# EAGLE design watering (EAGLE 8.3.1)
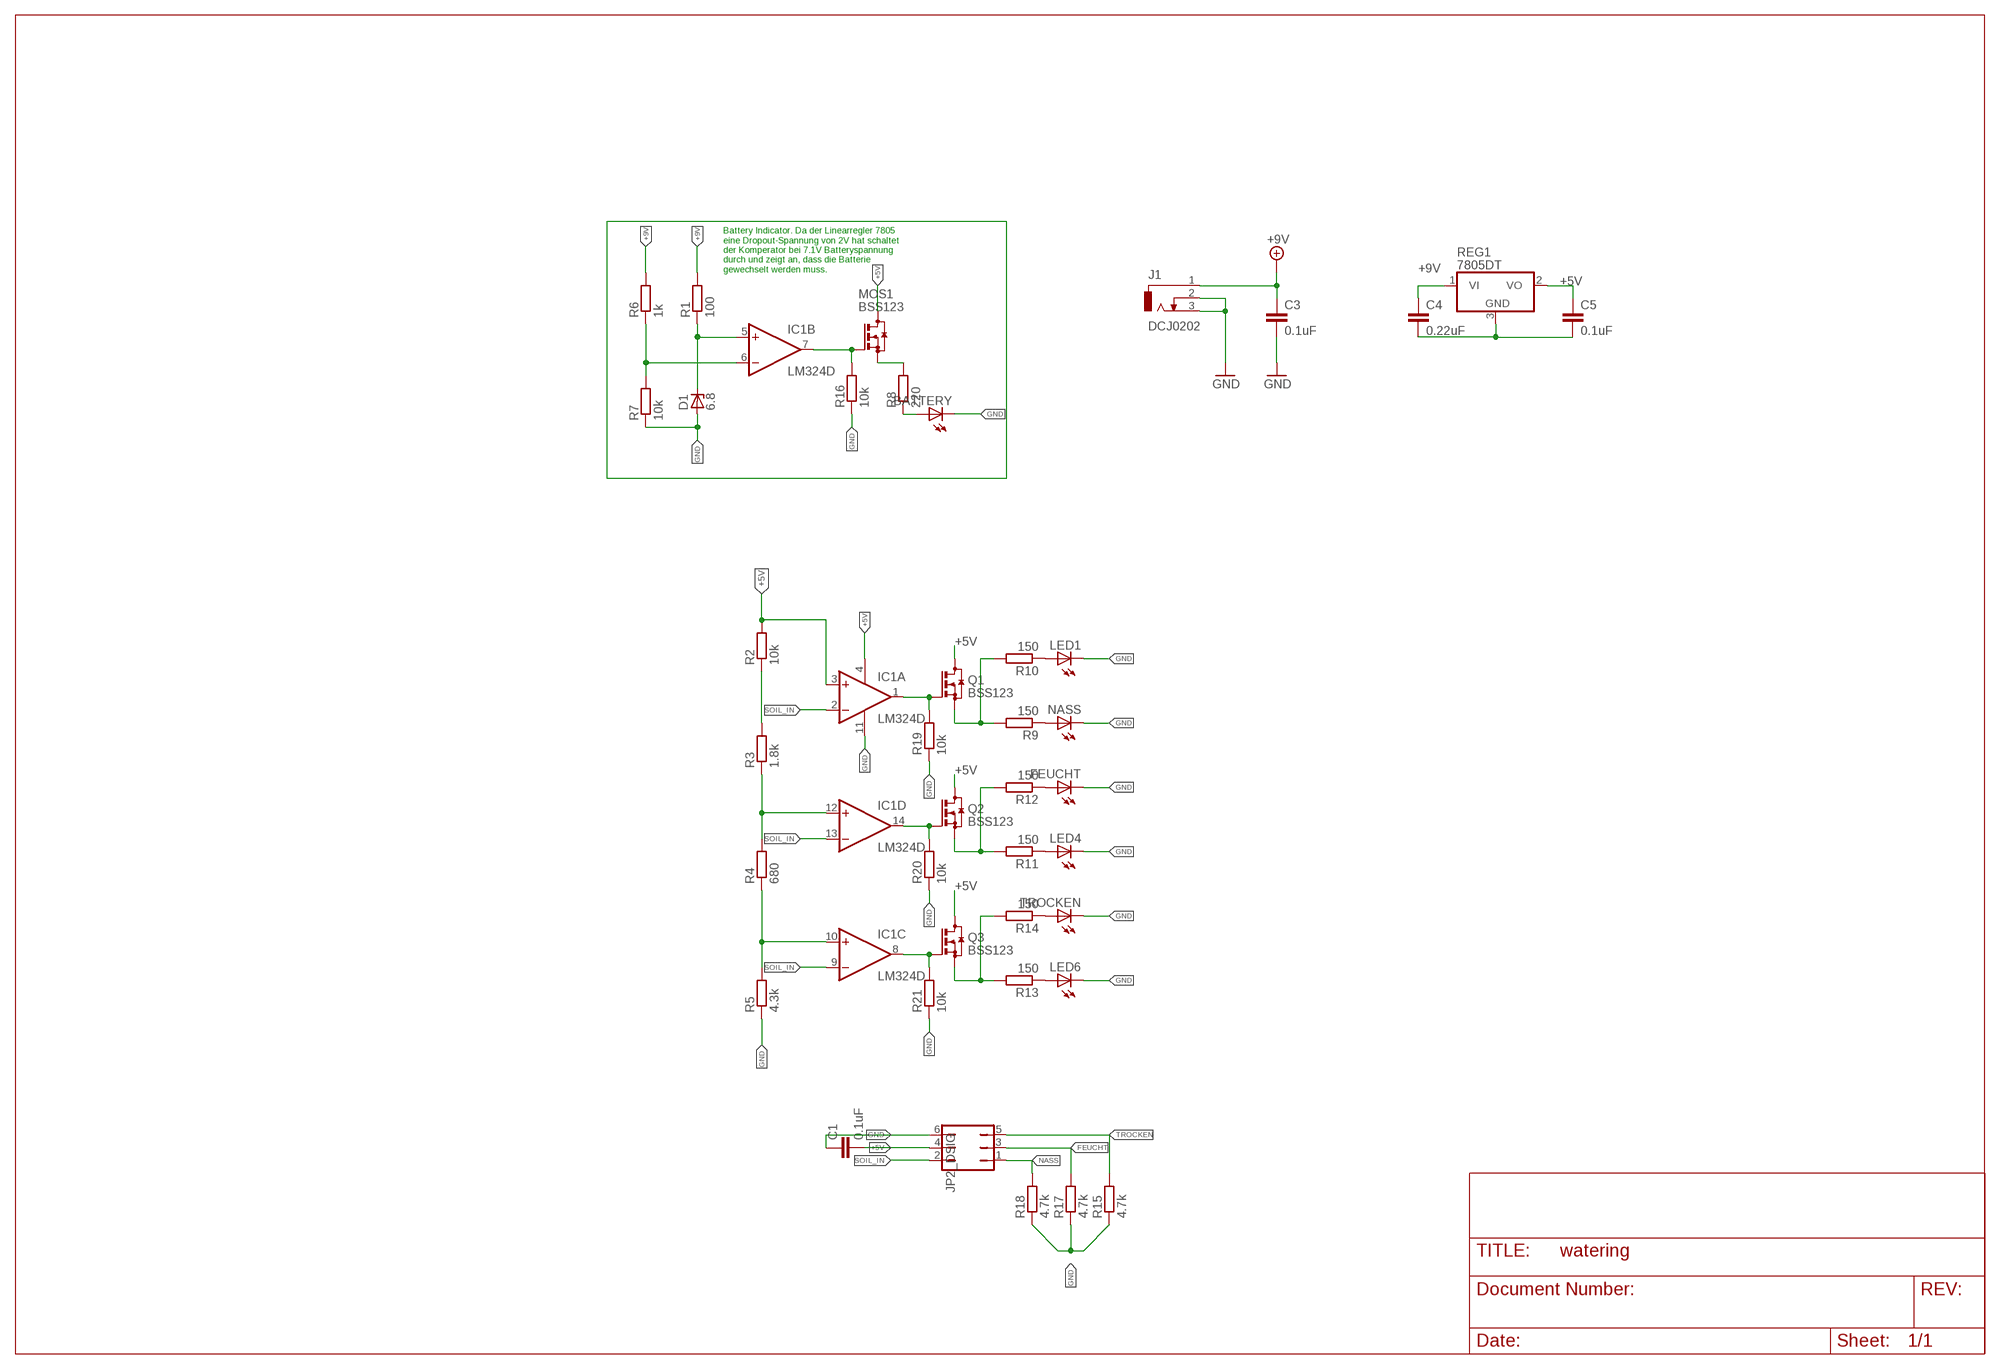
[diagram p0: schematic, sheet 1]

## Parts
BATTERY  LEDSML0805  [SML0805]
C1  0.1uF  C-EUC0805  [C0805]
C3  0.1uF  C-EUC0805  [C0805]
C4  0.22uF  C-EUC0805  [C0805]
C5  0.1uF  C-EUC0805  [C0805]
D1  6.8  ZENER-DIODESMB  [SMB]
FEUCHT  LEDSML0805  [SML0805]
IC1  LM324D  [SO14]
J1  DCJ0202  [DCJ0202]
JP1  JP2_DSIG  JP3Q  [JP3Q]
LED1  LEDSML0805  [SML0805]
LED4  LEDSML0805  [SML0805]
LED6  LEDSML0805  [SML0805]
MOS1  BSS123  [SOT23]
NASS  LEDSML0805  [SML0805]
Q1  BSS123  [SOT23]
Q2  BSS123  [SOT23]
Q3  BSS123  [SOT23]
R1  100  R-EU_M0805  [M0805]
R2  10k  R-EU_M0805  [M0805]
R3  1.8k  R-EU_M0805  [M0805]
R4  680  R-EU_M0805  [M0805]
R5  4.3k  R-EU_M0805  [M0805]
R6  1k  R-EU_M0805  [M0805]
R7  10k  R-EU_M0805  [M0805]
R8  220  R-EU_M0805  [M0805]
R9  150  R-EU_M0805  [M0805]
R10  150  R-EU_M0805  [M0805]
R11  150  R-EU_M0805  [M0805]
R12  150  R-EU_M0805  [M0805]
R13  150  R-EU_M0805  [M0805]
R14  150  R-EU_M0805  [M0805]
R15  4.7k  R-EU_M0805  [M0805]
R16  10k  R-EU_M0805  [M0805]
R17  4.7k  R-EU_M0805  [M0805]
R18  4.7k  R-EU_M0805  [M0805]
R19  10k  R-EU_M0805  [M0805]
R20  10k  R-EU_M0805  [M0805]
R21  10k  R-EU_M0805  [M0805]
REG1  7805DT  [TO252]
TROCKEN  LEDSML0805  [SML0805]

## Nets
+5V: C1.2 C5.1 IC1.3(A:+IN) IC1.4(P:V+) JP1.4 MOS1.3(D) Q1.3(D) Q2.3(D) Q3.3(D) R2.2 REG1.2(VO)
+9V: C3.1 C4.1 J1.1 R1.2 R6.2 REG1.1(VI)
FEUCHT: JP1.3 Q2.2(S) R11.2 R12.2 R17.2
GND: BATTERY.C C1.1 C3.2 C4.2 C5.2 D1.A FEUCHT.C IC1.11(P:V-) J1.2 J1.3 JP1.6 LED1.C LED4.C LED6.C NASS.C R5.1 R7.1 R15.1 R16.1 R17.1 R18.1 R19.1 R20.1 R21.1 REG1.3(GND) TROCKEN.C
N$1: R2.1 R3.2
N$2: IC1.1(A:OUT) Q1.1(G) R19.2
N$3: D1.C IC1.5(B:+IN) R1.1
N$4: IC1.14(D:OUT) Q2.1(G) R20.2
N$5: IC1.8(C:OUT) Q3.1(G) R21.2
N$6: IC1.6(B:-IN) R6.1 R7.2
N$7: IC1.7(B:OUT) MOS1.1(G) R16.2
N$8: MOS1.2(S) R8.2
N$9: BATTERY.A R8.1
N$10: LED1.A R10.1
N$11: IC1.12(D:+IN) R3.1 R4.2
N$12: IC1.10(C:+IN) R4.1 R5.2
N$13: NASS.A R9.1
N$21: FEUCHT.A R12.1
N$22: LED4.A R11.1
N$23: R14.1 TROCKEN.A
N$24: LED6.A R13.1
NASS: JP1.1 Q1.2(S) R9.2 R10.2 R18.2
SOIL_IN: IC1.2(A:-IN) IC1.9(C:-IN) IC1.13(D:-IN) JP1.2
TROCKEN: JP1.5 Q3.2(S) R13.2 R14.2 R15.2

## Notes on the sheet
- Battery Indicator. Da der Linearregler 7805
  eine Dropout-Spannung von 2V hat schaltet 
  der Komperator bei 7.1V Batteryspannung 
  durch und zeigt an, dass die Batterie 
  gewechselt werden muss.

## Library data of the parts
BATTERY FEUCHT LED1 LED4 LED6 NASS TROCKEN = led:LED: LED OSRAM: - CHIPLED LG R971, LG N971, LY N971, LG Q971, LY Q971, LO R971, LY R971 LH N974, LH R974 LS Q976, LO Q976, LY Q976 LO Q996 - Hyper CHIPLED LW Q18S LB Q993, LB Q99A, LB R99A - SideLED LS A670, LO A670, LY A670, LG A670, LP A670 LB A673, LV A673, LT A673, LW A673 LH A674 LY A675 LS A676, LA A676, LO A676, LY A676, LW A676 LS A679, LY A679, LG A679 - Hyper Micro SIDELED® LS Y876, LA Y876, LO Y876, LY Y876 LT Y87S - SmartLED LW L88C, LW L88S LB L89C, LB L89S, LG L890 LS L89K, LO L89K, LY L89K LS L896, LA L896, LO L896, LY L896 - TOPLED LS T670, LO T670, LY T670, LG T670, LP T670 LSG T670, LSP T670, LSY T670, LOP T670, LYG T670 LG T671, LOG T671, LSG T671 LB T673, LV T673, LT T673, LW T673 LH T674 LS T676, LA T676, LO T676, LY T676, LB T676, LH T676, LSB T676, LW T676 LB T67C, LV T67C, LT T67C, LS T67K, LO T67K, LY T67K, LW E67C LS E67B, LA E67B, LO E67B, LY E67B, LB E67C, LV E67C, LT E67C LW T67C LS T679, LY T679, LG T679 LS T770, LO T770, LY T770, LG T770, LP T770 LB T773, LV T773, LT T773, LW T773 LH T774 LS E675, LA E675, LY E675, LS T675 LS T776, LA T776, LO T776, LY T776, LB T776 LHGB T686 LT T68C, LB T68C - Hyper Mini TOPLED® LB M676 - Mini TOPLED Santana® LG M470 LS M47K, LO M47K, LY M47K Source: http://www.osram.convergy.de LUXEON: - LUMILED® LXK2-PW12-R00, LXK2-PW12-S00, LXK2-PW14-U00, LXK2-PW14-V00 LXK2-PM12-R00, LXK2-PM12-S00, LXK2-PM14-U00 LXK2-PE12-Q00, LXK2-PE12-R00, LXK2-PE12-S00, LXK2-PE14-T00, LXK2-PE14-U00 LXK2-PB12-K00, LXK2-PB12-L00, LXK2-PB12-M00, LXK2-PB14-N00, LXK2-PB14-P00, LXK2-PB14-Q00 LXK2-PR12-L00, LXK2-PR12-M00, LXK2-PR14-Q00, LXK2-PR14-R00 LXK2-PD12-Q00, LXK2-PD12-R00, LXK2-PD12-S00 LXK2-PH12-R00, LXK2-PH12-S00 LXK2-PL12-P00, LXK2-PL12-Q00, LXK2-PL12-R00 Source: www.luxeon.com KINGBRIGHT: KA-3528ASYC Source: www.kingbright.com
C1 C3-C5 = rcl:C-EU: CAPACITOR, European symbol
D1 = diode:ZENER-DIODE: Z-Diode
IC1 = linear:LM324: OP AMP
J1 = con-jack:DCJ0202: DC POWER JACK Source: DCJ0202.pdf; OC_FARNELL: unknown; OC_NEWARK: unknown
JP1 = jumper:JP3Q: JUMPER
MOS1 Q1-Q3 = transistor-small-signal:BSS123: N-CHANNEL MOS FET
R1-R21 = resistor:R-EU_: RESISTOR, European symbol
REG1 = linear:78*: Positive VOLTAGE REGULATOR Source: http://cache.national.com/ds/LM/LM78L05.pdf http://www.fairchildsemi.com/ds/LM/LM7805.pdf

## Board
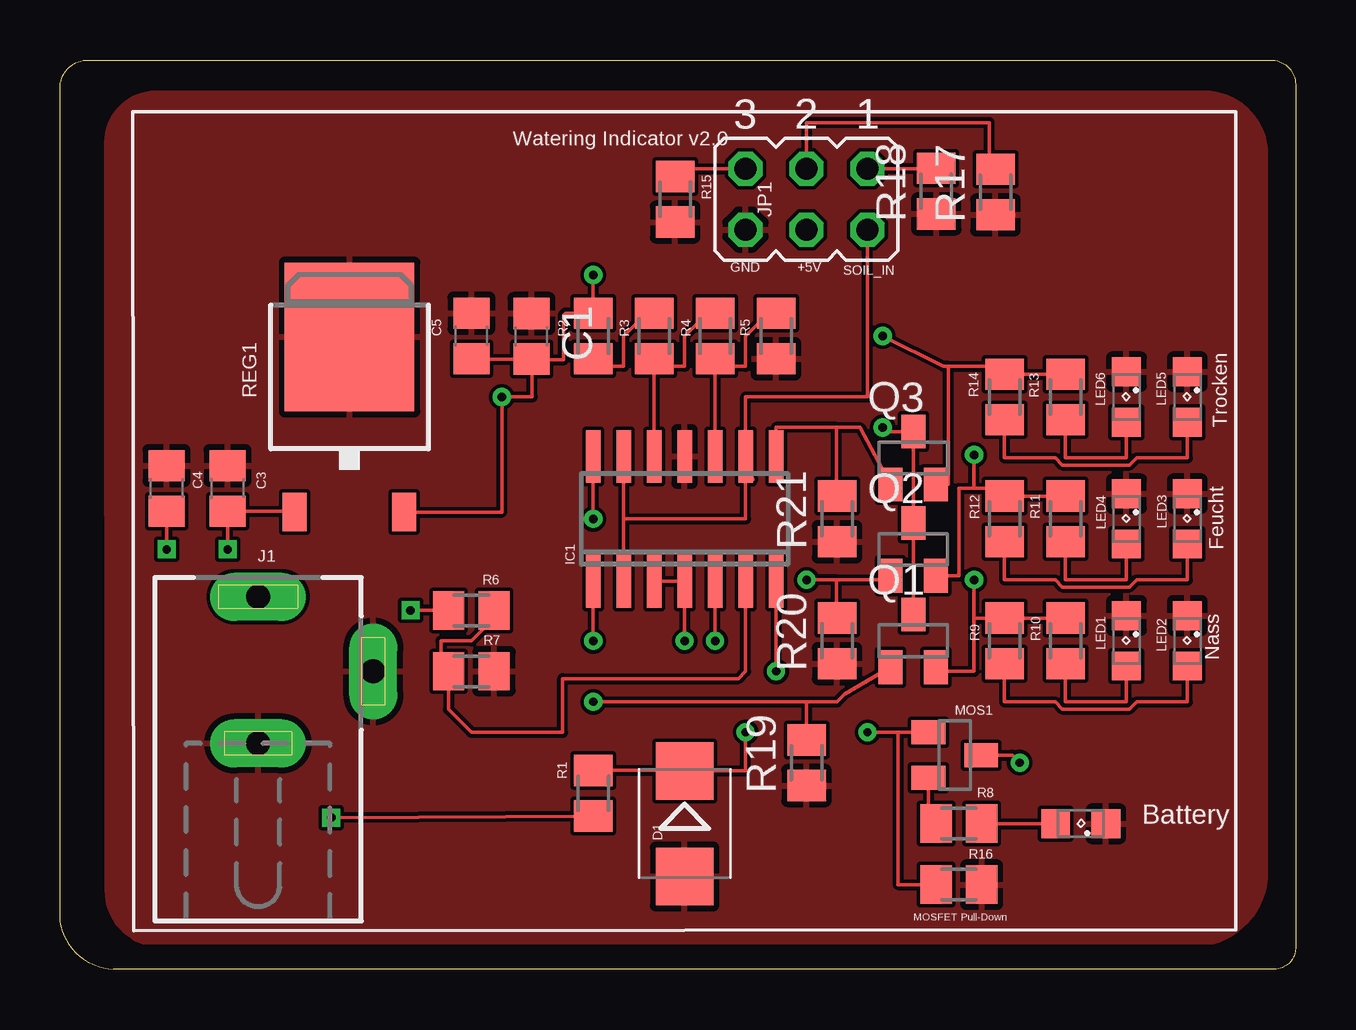
[diagram p1: board, top side]
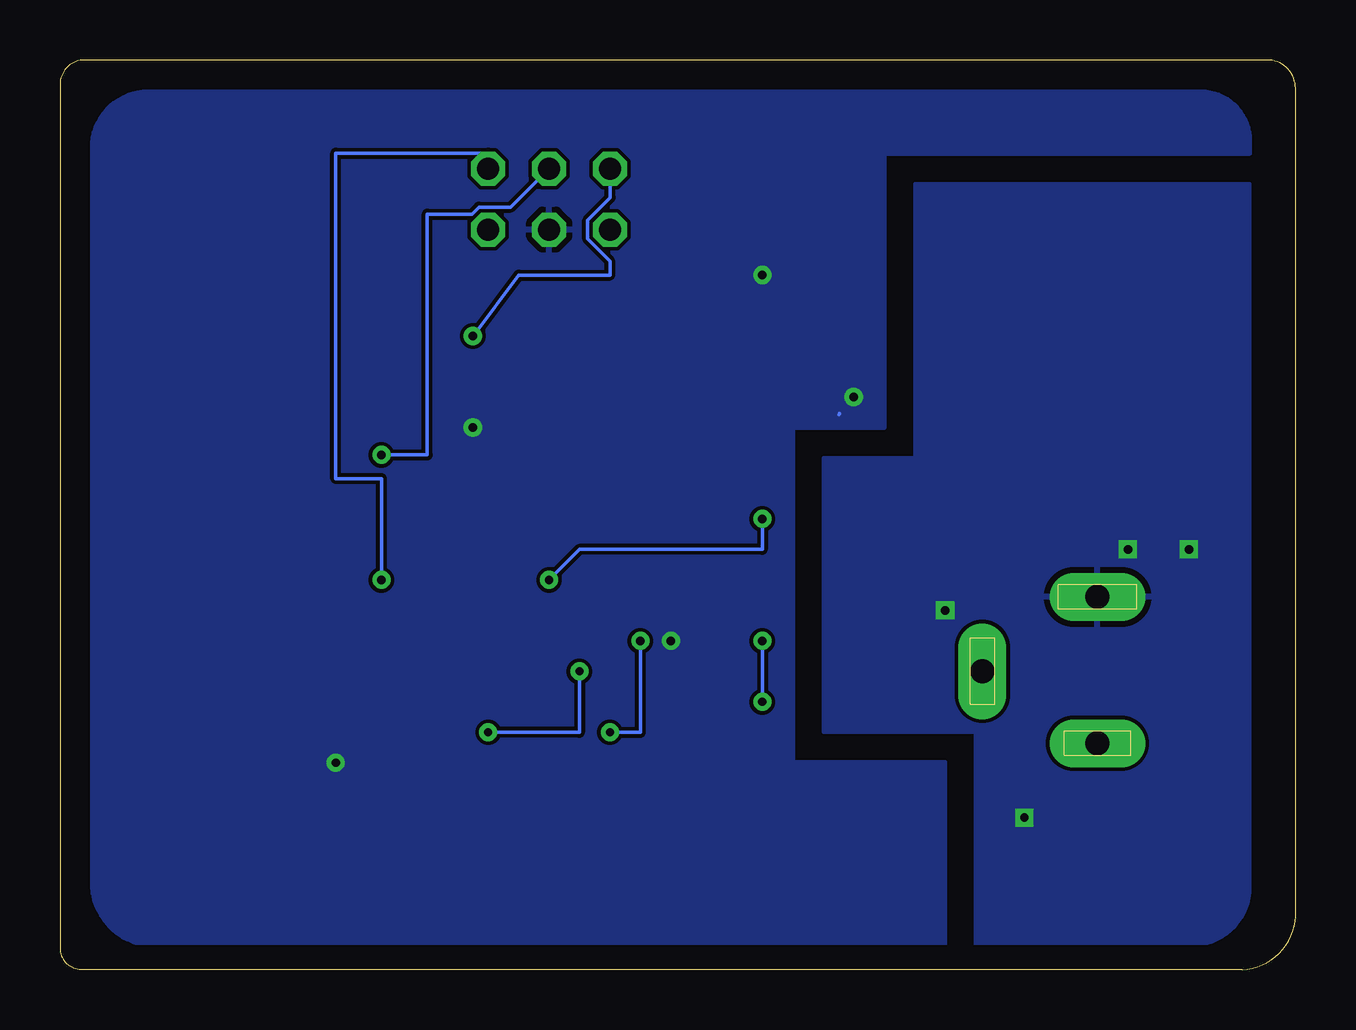
[diagram p2: board, bottom side, seen from below]

Size 51.5 x 37.9 mm. Coordinates in mm from the lower left corner, seen from the top.
Outline: 2.23,0 arc-90 0,2.44 0,36.71 arc-90 1.19,37.9 50.47,37.9 arc-90 51.5,36.87 51.5,0.9 arc-90 50.63,0.02 2.22,0.02
Copper layers (1*16): Top 0.035mm / dielectric 1.5mm / Bottom 0.035mm
Design rules "default": minimum track width 6mil, minimum drill 0.35mm, track to track 6mil, track to pad 6mil, pad to pad 6mil, via to via 6mil, smd to smd 6mil, copper to edge 40mil, drill to drill 6mil, minimum pad ring 10mil, minimum via ring 8mil, stop-mask expansion 4mil, vias tented up to drill 0mil, thermal gap 10mil

### Footprints (pad centres in the part's own frame; a part is rotated, then mirrored left to right if it is on the bottom)
SML0805 = smd 1.2 x 1.2: A 1.05,0; C -1.05,0
C0805 = smd 1.3 x 1.5: 1 -0.95,0; 2 0.95,0
SMB = smd 2.4 x 2.4: A 2.2,0; C -2.2,0
SO14 = smd 0.6 x 2.2: 1 -3.81,-2.6; 2 -2.54,-2.6; 3 -1.27,-2.6; 4 0,-2.6; 5 1.27,-2.6; 6 2.54,-2.6; 7 3.81,-2.6; 8 3.81,2.6; 9 2.54,2.6; 10 1.27,2.6; 11 0,2.6; 12 -1.27,2.6; 13 -2.54,2.6; 14 -3.81,2.6
DCJ0202 = drill 1 pad 2 long: 1 0,3.1; 2 4.8,0; 3 0,-3
JP3Q = drill 0.914 octagon: 1 -2.54,-1.27; 2 -2.54,1.27; 3 0,-1.27; 4 0,1.27; 5 2.54,-1.27; 6 2.54,1.27
SOT23 = smd 1 x 1.4: 1 -0.95,-1.1; 2 0.95,-1.1; 3 0,1.1
M0805 = smd 1.3 x 1.6: 1 -0.95,0; 2 0.95,0
TO252 = smd 1 x 1.6: 1 -2.28,-4.8; 2 2.28,-4.8 | smd 5.4 x 6.2: 3 0,2.5

### Placement (x,y rotation side)
BATTERY  42.55,6.08 180 top
C1  19.65,26.39 270 top
C3  6.99,20.05 90 top
C4  4.45,20.05 90 top
C5  17.15,26.4 90 top
D1  26.04,6.08 270 top
DRILEGEND  [DRILEGEND]  -1.74,-4.38 0 top  (outside the outline)
FEUCHT  46.99,18.78 270 top
IC1  26.04,18.78 0 top
J1  8.26,12.43 0 top
JP1  31.11,32.1 180 top
LED1  44.45,13.7 270 top
LED4  44.45,18.78 270 top
LED6  44.45,23.86 270 top
MOS1  37.3,8.94 270 top
NASS  46.99,13.7 270 top
Q1  35.56,13.7 0 top
Q2  35.56,17.51 0 top
Q3  35.56,21.32 0 top
R1  22.23,7.35 270 top
R2  22.23,26.4 90 top
R3  24.77,26.4 90 top
R4  27.31,26.4 90 top
R5  29.85,26.4 90 top
R6  17.15,14.97 180 top
R7  17.15,12.43 180 top
R8  37.47,6.08 180 top
R9  39.37,13.7 90 top
R10  41.91,13.7 90 top
R11  41.91,18.78 90 top
R12  39.37,18.78 90 top
R13  41.91,23.86 90 top
R14  39.37,23.86 90 top
R15  25.64,32.09 90 top
R16  37.47,3.54 180 top
R17  38.99,32.39 90 top
R18  36.53,32.43 90 top
R19  31.12,8.62 90 top
R20  32.39,13.7 90 top
R21  32.39,18.78 90 top
REG1  12.07,23.86 0 top
TROCKEN  46.99,23.86 270 top

### Tracks (layer width: path | path; a pad name or v marks a point on that pad's centre or on a via)
+5V  (via drill 0.35)
  Top 0.152: v22.23,28.94 R2.2 21.07,27.35 20.99,27.27 20.99,25.4 19.68,25.4 | v26.04,13.7 IC1.4 IC1.3 | MOS1.3 39.69,8.94 v40.01,8.62 | 19.68,25.4 C1.2 C5.1 | v34.29,22.59 34.29,22.42 Q3.3 Q2.3 Q1.3 | REG1.2 18.42,19.06 v18.42,23.86 19.68,23.86 19.68,25.4
  Bottom 0.152: 19.02,23.18 19.02,23.14 19.04,23.12
  pour Bottom: 1.91,34.02 1.91,34.53 arc-90 3.94,36.56 47.85,36.56 arc-90 50.17,34.24 50.17,3.66 arc-90 47.5,1 14.61,1 14.61,8.62 20.96,8.62 20.96,22.59 17.15,22.59 17.15,34.02
+9V  (via drill 0.35)
  Top 0.152: R6.2 v14.61,14.97 | R1.2 v11.31,6.33 | v6.99,17.51 C3.1 9.75,19.1 REG1.1 | C4.1 v4.45,17.51
  pour Bottom: 13.34,1 4.35,1 arc-90 1.91,3.44 1.91,32.75 15.88,32.75 15.88,21.32 19.69,21.32 19.69,9.89 13.34,9.89
FEUCHT  (via drill 0.35)
  Top 0.152: R11.2 R12.2 39.37,20.05 38.1,20.05 | R17.2 38.74,33.6 38.74,35.29 31.12,35.29 31.11,35.28 JP1.3 | Q2.2 37.47,16.41 37.47,20.05 38.1,20.05 | 38.1,20.05 v38.1,21.45
  Bottom 0.152: v38.1,21.45 36.2,21.45 36.2,31.48 34.33,31.48 34.04,31.77 32.71,31.77 JP1.3
GND
  pour Top: 47.23,1 4.24,0.98 arc-90 1.93,3.29 1.91,34.47 arc-90 3.99,36.56 47.69,36.56 arc-90 50.29,33.96 50.29,4.06 arc-90
N$1
  Top 0.152: R3.2 24.45,27.35 23.5,26.4 23.5,25.13 22.55,25.13 R2.1 22.23,25.13
N$2  (via drill 0.35)
  Top 0.152: IC1.1 v22.23,13.7 | v22.23,11.16 31.12,11.16 | 31.12,11.16 32.39,11.16 32.71,11.48 Q1.1 | 31.12,11.16 R19.2
  Bottom 0.152: v22.23,13.7 v22.23,11.16
N$3  (via drill 0.35)
  Top 0.152: R1.1 26.04,8.3 D1.C 28.58,8.28 v28.58,9.89 | v27.31,13.7 IC1.5
  Bottom 0.152: v28.58,9.89 27.31,9.89 v27.31,13.7
N$4  (via drill 0.35)
  Top 0.152: IC1.14 v22.23,18.78 | 32.36,16.24 v31.12,16.24 | 32.36,16.24 34.29,16.24 34.46,16.41 Q2.1 | R20.2 32.36,14.65 32.36,16.24
  Bottom 0.152: v22.23,18.78 22.23,17.51 29.85,17.51 v31.12,16.24
N$5
  Top 0.152: IC1.8 29.85,22.59 32.36,22.59 | 32.36,22.59 33.34,22.59 Q3.1 | R21.2 32.36,19.73 32.36,22.59
N$6
  Top 0.152: R6.1 18.1,14.65 17.15,13.7 15.88,13.7 15.88,12.75 R7.2 16.2,10.84 17.15,9.89 20.96,9.89 20.96,12.12 28.27,12.12 28.58,12.43 IC1.6
N$7  (via drill 0.35)
  Top 0.152: IC1.7 v29.85,12.43 | v33.66,9.89 34.93,9.89 | 34.93,9.89 MOS1.1 | 34.93,9.89 34.93,3.54 R16.2
  Bottom 0.152: v29.85,12.43 29.85,9.89 v33.66,9.89
N$8
  Top 0.152: MOS1.2 36.2,6.4 R8.2
N$9
  Top 0.152: R8.1 BATTERY.A
N$10
  Top 0.152: R10.1 41.91,11.16 44.45,11.16 LED1.A
N$11
  Top 0.152: 24.77,25.34 R3.1 | 24.77,25.34 IC1.12 | R4.2 26.99,27.35 26.04,26.4 26.04,25.13 24.98,25.13 24.77,25.34
N$12
  Top 0.152: R5.2 29.53,27.35 28.58,26.4 28.58,25.13 27.63,25.13 R4.1 IC1.10
N$13
  Top 0.152: R9.1 39.37,11.16 41.48,11.16 41.79,10.85 44.58,10.85 44.88,11.16 46.99,11.16 NASS.A
N$21
  Top 0.152: R12.1 39.37,16.24 41.48,16.24 41.79,15.93 44.58,15.93 44.88,16.24 46.99,16.24 FEUCHT.A
N$22
  Top 0.152: R11.1 41.91,16.24 44.45,16.24 LED4.A
N$23
  Top 0.152: R14.1 39.37,21.32 41.48,21.32 41.79,21.01 44.58,21.01 44.88,21.32 46.99,21.32 TROCKEN.A
N$24
  Top 0.152: R13.1 41.91,21.32 44.45,21.32 LED6.A
NASS  (via drill 0.35)
  Top 0.152: 38.1,14.65 R9.2 R10.2 | R18.2 36.52,33.37 JP1.1 | 38.1,14.65 v38.1,16.24 | Q1.2 36.68,12.43 38.1,12.43 38.1,14.65
  Bottom 0.152: 33.65,33.28 JP1.1 33.65,34.02 40.01,34.02 40.01,20.46 38.1,20.46 v38.1,16.24
SOIL_IN
  Top 0.152: IC1.9 28.88,20.41 | IC1.9 28.58,23.86 33.66,23.86 33.65,23.86 JP1.2 | IC1.13 23.5,18.78 | 23.5,18.78 IC1.2 | 23.5,18.78 28.58,18.78 IC1.9
TROCKEN  (via drill 0.35)
  Top 0.152: R13.2 R14.2 39.05,25.13 37.04,25.13 | 37.04,25.13 36.83,25.13 v34.29,26.4 | R15.2 25.97,33.37 JP1.5 | Q3.2 37.04,20.22 37.04,25.13
  Bottom 0.152: v34.29,26.4 32.39,28.94 28.58,28.94 28.58,29.51 29.51,30.44 29.51,31.22 28.57,32.16 JP1.5

### Text on the board
tPlace: Watering Indicator v2.0 | GND | +5V | SOIL_IN | LED5 | Trocken | LED3 | Feucht | LED2 | Nass | Battery | MOSFET Pull-Down